# Altium schematic sheet can.SchDoc
size A3; DocumentNumber: 3; SheetNumber: 3; SheetTotal: 45; SheetDescription: CAN Communication
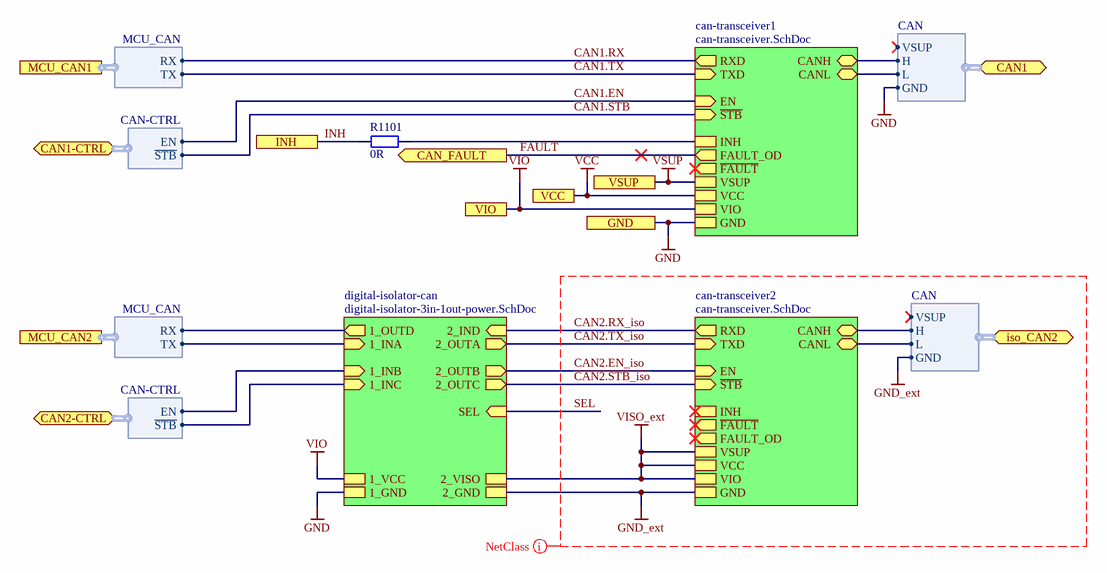
[diagram p0: can.SchDoc]

## Parts
R1101  0R  [RESC1005X04N]

## Sub-sheets
can-transceiver1 = can-transceiver.SchDoc: TXD (in), CANL (bidir), INH, RXD (out), VCC, EN (in), GND, CANH (bidir), VSUP, ~{STB} (in), VIO, ~{FAULT} (out), FAULT_OD (out)
can-transceiver2 = can-transceiver.SchDoc: TXD (in), CANL (bidir), INH, RXD (out), VCC, EN (in), GND, CANH (bidir), VSUP, ~{STB} (in), VIO, FAULT_OD (out), ~{FAULT} (out)
digital-isolator-can = digital-isolator-3in-1out-power.SchDoc: 2_OUTA (out), 1_VCC, 2_OUTB (out), 2_GND, 2_IND (in), 1_INA (in), 1_INB (in), 1_INC (in), 1_GND, 1_OUTD (out), 2_OUTC (out), 2_VISO, SEL (in)

## Ports
CAN1 (bidir, harness CAN), CAN1-CTRL (bidir, harness CAN-CTRL), CAN2-CTRL (bidir, harness CAN-CTRL), CAN_FAULT (out), GND, INH, iso_CAN2 (bidir, harness CAN), MCU_CAN1 (harness MCU_CAN), MCU_CAN2 (harness MCU_CAN), VCC, VIO, VSUP

## Harnesses
CAN: H, L, GND, VSUP
CAN-CTRL: EN, ~{STB}
MCU_CAN: RX, TX

## Nets
GND: port GND, sheet can-transceiver1/GND, sheet digital-isolator-can/1_GND, port CAN1.GND
GND_ext: sheet can-transceiver2/GND, sheet digital-isolator-can/2_GND, port iso_CAN2.GND
VCC: port VCC, sheet can-transceiver1/VCC
VIO: port VIO, sheet can-transceiver1/VIO, sheet digital-isolator-can/1_VCC
VISO_ext: sheet can-transceiver2/VCC, sheet can-transceiver2/VSUP, sheet can-transceiver2/VIO, sheet digital-isolator-can/2_VISO
VSUP: port VSUP, sheet can-transceiver1/VSUP
~{CAN1.STB}: sheet can-transceiver1/~{STB}, port CAN1-CTRL.~{STB}
~{CAN2.STB_iso}: sheet can-transceiver2/~{STB}, sheet digital-isolator-can/2_OUTC
CAN1.EN: sheet can-transceiver1/EN, port CAN1-CTRL.EN
CAN1.RX: sheet can-transceiver1/RXD, port MCU_CAN1.RX
CAN1.TX: sheet can-transceiver1/TXD, port MCU_CAN1.TX
CAN2.EN_iso: sheet can-transceiver2/EN, sheet digital-isolator-can/2_OUTB
CAN2.RX_iso: sheet can-transceiver2/RXD, sheet digital-isolator-can/2_IND
CAN2.TX_iso: sheet can-transceiver2/TXD, sheet digital-isolator-can/2_OUTA
FAULT: port CAN_FAULT, sheet can-transceiver1/FAULT_OD
INH: R1101.2 ; port INH
SEL: sheet digital-isolator-can/SEL
NetR1101_1: R1101.1 ; sheet can-transceiver1/INH
(unnamed): sheet can-transceiver1/CANL, port CAN1.L
(unnamed): sheet can-transceiver1/CANH, port CAN1.H
(unnamed): sheet can-transceiver2/CANL, port iso_CAN2.L
(unnamed): sheet can-transceiver2/CANH, port iso_CAN2.H
(unnamed): sheet digital-isolator-can/1_INA, port MCU_CAN2.TX
(unnamed): sheet digital-isolator-can/1_INB, port CAN2-CTRL.EN
(unnamed): sheet digital-isolator-can/1_INC, port CAN2-CTRL.~{STB}
(unnamed): sheet digital-isolator-can/1_OUTD, port MCU_CAN2.RX

## Layout directives
net class iso_CAN2: CAN2.EN_iso, CAN2.RX_iso, CAN2.TX_iso, GND_ext, SEL, VISO_ext, ~{CAN2.STB_iso}

## Notes on the sheet
- Fraunhofer IISB
- Schottkystr. 10
- developed by:
- 91058 Erlangen
- Germany
- Author
- Project
- License
- Description
- File
- Version
- Release Date
- Sheet
- foxbms.org <https://foxbms.org>
- www.iisb.fraunhofer.de <https://www.iisb.fraunhofer.de/>
- foxBMS Team
- /

## Library data of the parts
R1101 = gen_R_0R_0402: SMD Resistor 0R 0402; Power: 0.063W; Case EIA: 0402; Case Metric: 1005; Maximum Working Voltage: 50V; PnP Package: 0402R; Automotive Qualified: True; AEC-Q Norm: AEC-Q200; PnP equipped: x; Part Number: gen_R_0R_0402; Operating Temperature: -55°C - +155°C; Resistance: 0R; Series: Jumper; PnP Value: 0R; Supplier 1: Farnell; Supplier Part Number 1: 1469661; Supplier 2: Farnell; Supplier Part Number 2: 2059190; ECCN: EAR99